# Altium schematic sheet chipshouter-pico-hv.SchDoc: High Voltage Circuitry
size Letter; Organization: NewAE Technology Inc.; Address1: 1083 Queen St., Suite 196; Address2: Halifax; Address3: NS; Address4: Canada B3H 0B2; DocumentNumber: .; Revision: .; SheetNumber: 1; SheetTotal: 2; SheetApproved: YES
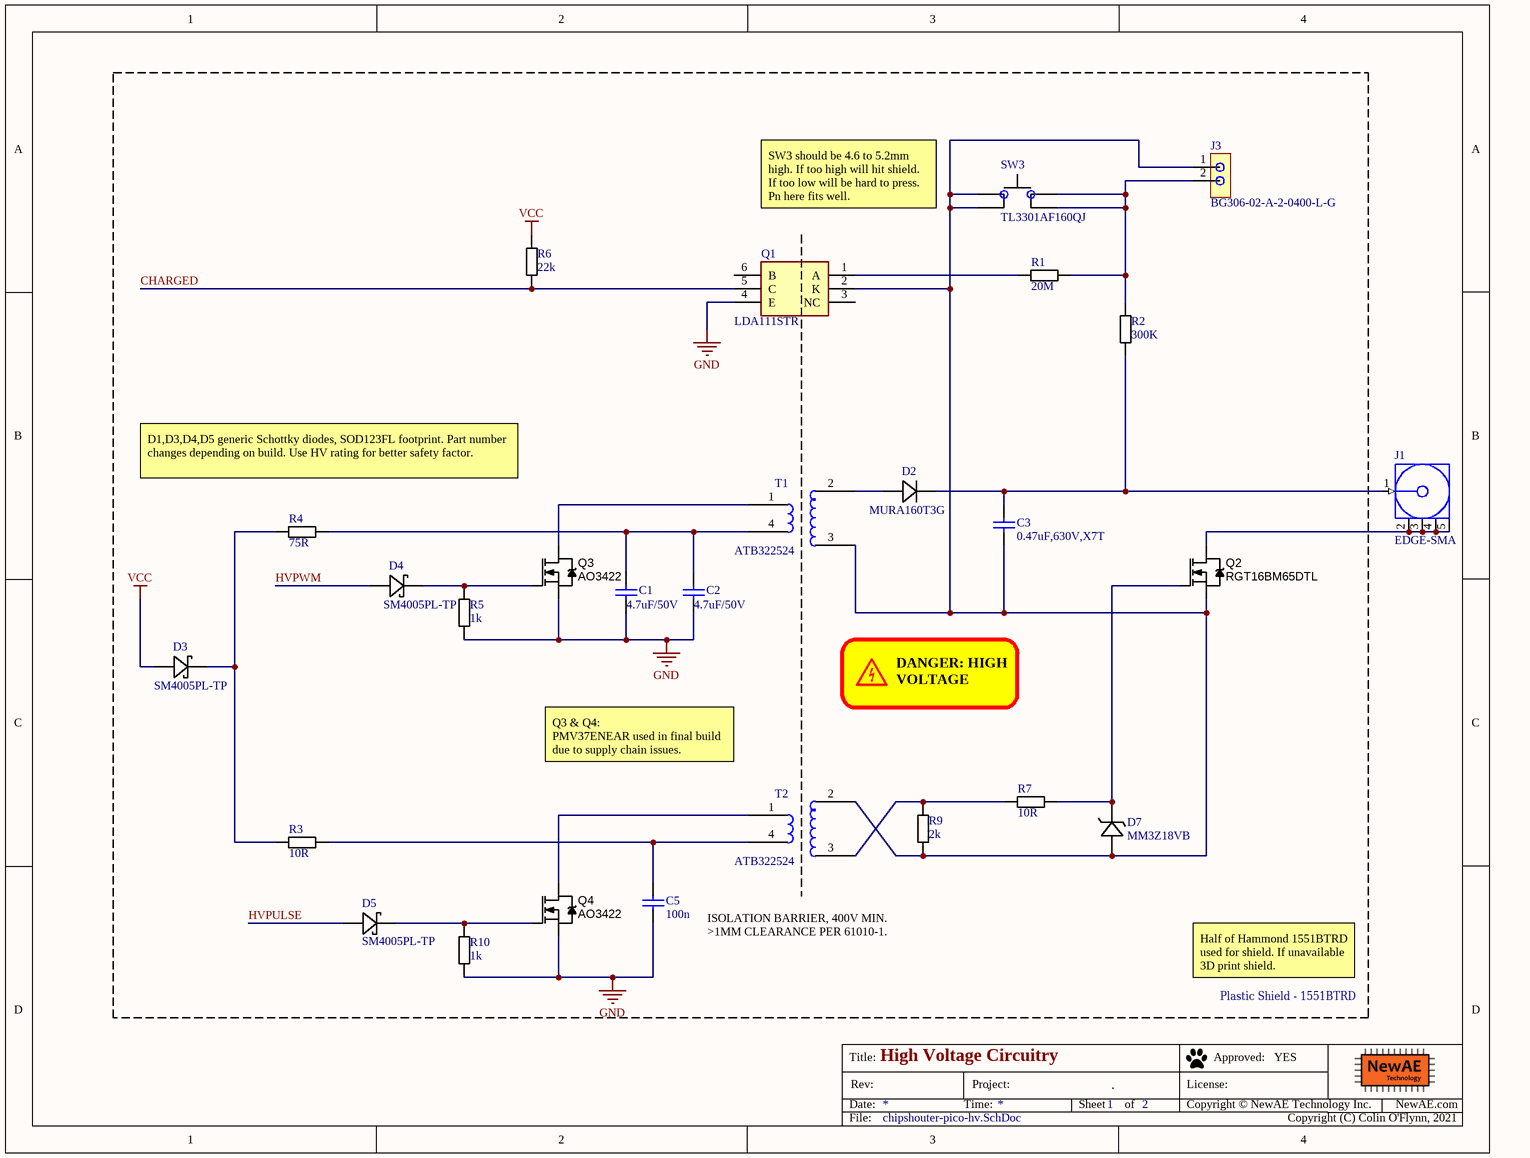
[diagram p0: chipshouter-pico-hv.SchDoc]

## Parts
C1  4.7uF/50V  [CAPC0805_M]
C2  4.7uF/50V  [CAPC0805_M]
C3  0.47uF,630V,X7T  [CKG57N_2220]
C5  100n  [CAPC0603_M]
D2  MURA160T3G  [DO-214AC]
D3  SM4005PL-TP  [DSS13UTR]
D4  SM4005PL-TP  [DSS13UTR]
D5  SM4005PL-TP  [DSS13UTR]
D7  MM3Z18VB  [SOD323]
J1  EDGE-SMA  [CON-SMA-MALE-PCB-EDGE062]
J3  BG306-02-A-2-0400-L-G  [BG306-R2-2PIN]
Q1  LDA111STR  [SOP254P952X470-6N]
Q2  RGT16BM65DTL  [DPAK_TO-252AA_M]
Q3  AO3422  [SOT95P245X110-3M]
Q4  AO3422  [SOT95P245X110-3M]
R1  20M  [RESC5025X06N]
R2  300K  [RESC6432X06N]
R3  10R  [RESC1608X55N]
R4  75R  [RESC2012X70N]
R5  1k  [RESC1608X55N]
R6  22k  [RESC1608X55N]
R7  10R  [RESC1608X55N]
R9  2k  [RESC2012X70N]
R10  1k  [RESC1608X55N]
SW3  TL3301AF160QJ  [CK_KSC7J]
T1  ATB322524  [ATB322524_CHUNKY]
T2  ATB322524  [ATB322524_CHUNKY]

## Blocks framed on the sheet
Plastic Shield - 1551BTRD‎: C1-C3 C5 D2-D5 D7 J3 Q1-Q4 R1-R7 R9 R10 SW3 T1 T2

## Nets
GND: C1.2 C2.2 C5.2 Q1.4(E) Q3.2(S) Q4.2(S) R5.2 R10.2
VCC: D3.A R6.1
CHARGED: Q1.5(C) R6.2
HVPULSE: D5.A
HVPWM: D4.A
NetC1_1: C1.1 C2.1 R4.2 T1.4
NetC3_1: C3.1 D2.K J1.1(Signal) R2.2
NetC3_2: C3.2 D7.A J3.1 Q1.2(K) Q2.2(S) R9.2 SW3.1(IN) SW3.4(IN) T1.3 T2.2
NetC5_1: C5.1 R3.2 T2.4
NetD2_A: D2.A T1.2
NetD3_K: D3.K R3.1 R4.1
NetD4_K: D4.K Q3.1(G) R5.1
NetD5_K: D5.K Q4.1(G) R10.1
NetD7_K: D7.K Q2.1(G) R7.2
NetJ1_2: J1.2(GND) J1.3(GND) J1.4(GND) J1.5(GND) Q2.3(D)
NetJ3_2: J3.2 R1.2 R2.1 SW3.2(IN) SW3.3(IN)
NetQ1_1: Q1.1(A) R1.1
NetQ3_3: Q3.3(D) T1.1
NetQ4_3: Q4.3(D) T2.1
NetR7_1: R7.1 R9.1 T2.3

Not connected (* = marked no-connect by the designer): Q1 3(NC) 6(B)

## Notes on the sheet
- SW3 should be 4.6 to 5.2mm high. If too high will hit shield. If too low will be hard to press. Pn here fits well.
- D1,D3,D4,D5 generic Schottky diodes, SOD123FL footprint. Part number changes depending on build. Use HV rating for better safety factor.
- DANGER: HIGH
  VOLTAGE
- Q3 & Q4:
  PMV37ENEAR used in final build due to supply chain issues.
- ISOLATION BARRIER, 400V MIN.
  >1MM CLEARANCE PER 61010-1.
- Half of Hammond 1551BTRD used for shield. If unavailable 3D print shield.
- Copyright (C) Colin O'Flynn, 2021
- Title:
- Date:
- Rev:
- Time:
- Project:
- Sheet
- of
- License:
- Copyright © NewAE Technology Inc.
- Approved:
- NewAE.com
- File:

## Library data of the parts
C1 C2 = CCHIP-4u7-0805-50V: 4u7, 50V, 0805, Ceramic; Manufacture 1: TDK Corporation; Manufacture Part Number 1: C2012X5R1H475K125AB; Component Group: Capacitor; Value: 4.7uF; Case-EIA: 0805; Case-Metric: 1608; Rated Voltage: 50VDC; Tolerance: 10%; Part Number: CCHIP-4u7-0805-50V; Footprint: 0805; Pin Count: 2; Supplier 1: Digi-Key; Supplier Part Number 1: 445-5980-1-ND; Mounting Technology: SMT; RoHS: Yes; Temperature Range: -55C to 85C; Component Kind: Standard; Component Type: Standard
C3 = CKG57NX7T2J105M500JH: 1uF, 630V, X7T, Stacked; Part Number: KRM55TR72J474MH01K; Manufacture 1: TDK Corporation; Component Group: Capacitor; Case-EIA: 2220; Case-Metric: 5750; Tolerance: +22/-30; Manufacture Part Number 1: KRM55TR72J474MH01K; Pin Count: 2; Supplier 1: Digi-Key; Supplier Part Number 1: 445-7110-1-ND; Value: 0.47uF, 630V, X7T; Rated Voltage: 630V; ComponentLink1Description: Tech Spec Page; ComponentLink1URL: https://product.tdk.com/en/search/capacitor/ceramic/mlcc/info?part_no=CKG57NX7T2J105M500JJ; Component Kind: Standard; Component Type: Standard
C5 = CCHIP-100n-0603: 100n, 0603; Manufacture 1: Kemet; Manufacture Part Number 1: C0603C104K5RACTU; Component Group: Capacitor; Case-EIA: 0603; Case-Metric: 1608; Rated Voltage: 50VDC; Part Number: CCHIP-100n-0603; Footprint: 0603; Pin Count: 2; Supplier 1: Digi-Key; Supplier Part Number 1: 399-5089-2-ND; Value: 100n; Mounting Technology: SMT; Component Kind: Standard; Component Type: Standard
D2 = MURA160T3G: 600V, 2A, Fast Recovery Diode; Manufacture 1: On Semi; Part Number: MURA160T3G; Component Group: Diode; Footprint: SMA; Manufacture Part Number 1: MURA160T3G; Pin Count: 2; Supplier 1: Digi-Key; Supplier Part Number 1: MURA160T3GOSCT-ND; Rated Power: 2A; Rated Voltage: 600V; Mounting Technology: SMT; RoHS: Yes; Temperature Range: -65C to 175C; Component Kind: Standard; Component Type: Standard
D3-D5 = DSS13UTR: SCHOTTKY 30V SOD-123FL; Manufacture 1: MCC; Component Group: Diode; PP Material Stack: 0; Part Number: DSS13UTR; Manufacture Part Number 1: SM4005PL-TP; Pin Count: 2; Supplier 1: Digi-Key; Supplier Part Number 1: 1655-1926-1-ND; Mounting Technology: SMT; RoHS: Yes; Component Kind: Standard; Component Type: Standard; PP Rotation: 0
D7 = PDZ10B: DIODE ZENER 10V 400MW SOD323; Manufacture 1: On Semiconductor; Rated Power: 0.4W; Tolerance: 2%; PP Material Stack: 0; Part Number: MM3Z18VB; Component Group: Diode; Manufacture Part Number 1: MM3Z18VB; Pin Count: 2; Supplier 1: Digi-Key; Supplier Part Number 2: 771-PDZ10B115; Supplier 2: Mouser; Rated Voltage: 10V; Mounting Technology: SMT; RoHS: Yes; Component Kind: Standard; Component Type: Standard; PP Rotation: 0
J1 = CON-F-SMA-PCBEDGE-003.062: SMA MaleEdge Mount Connector for 0.062" Thick Board; Manufacture 1: Linx Technologies; Manufacture Part Number 1: CONSMA013.062; Part Number: CON-F-SMA-PCBEDGE-003.062; Component Group: Connector; Pin Count: 5; Supplier 1: Digi-Key; Supplier Part Number 1: CONSMA013.062-ND; ComponentLink1Description: Manufacturer URL; ComponentLink1URL: http://www.linxtechnologies.com/; ComponentLink2Description: Datasheet; ComponentLink2URL: http://www.connectorcity.com/diagrams/SMA/CONSMA003.062.pdf; Component Kind: Standard; Component Type: Standard
J3 = BG306-02-A-2-0400-L-G: 2-Pin SMD, Female Header, 0.1" spacing; Manufacture 1: GCT; Component Group: Connector; PP Material Stack: 0; Part Number: BG306-02-A-2-0400-L-G; Footprint: BG306-R2; Manufacture Part Number 1: BG306-02-A-2-0400-L-G; Pin Count: 2; Supplier 1: Digi-Key; Component Kind: Standard; Component Type: Standard; PP Rotation: 0; PP Rotation1: 0
Q1 = LDA111STR: Phototransistor; Manufacturer_Name: IXYS SEMICONDUCTOR; Datasheet Link: https://datasheet.datasheetarchive.com/originals/dk/DKDS-13/255385.pdf; Height: 4.699mm; Manufacturer_Part_Number: LDA111STR; Mouser Part Number: 849-LDA111STR; Mouser Price/Stock: https://www.mouser.co.uk/ProductDetail/IXYS-Integrated-Circuits/LDA111STR?qs=lQlU%252BwB40guZJ8WaenQLCg%3D%3D; Arrow Part Number: LDA111STR; Arrow Price/Stock: https://www.arrow.com/en/products/lda111str/ixys
Q2 = IRLR120TRPBF: MOSFET N-CH 100V 7.7A DPAK; Manufacture 1: Vishay Siliconix; Part Number: IRLR120TRPBF; Component Group: MOSFET; Footprint: DPAK; Manufacture Part Number 1: IRLR120TRPBF; Pin Count: 3; Supplier 1: Digi-Key; Supplier Part Number 1: IRLR120TRPBFCT-ND; Rated Voltage: 100V; Mounting Technology: SMT; RoHS: Yes; Component Kind: Standard; Component Type: Standard
Q3 Q4 = DMN3200U-7: MOSFET N-CH 30V 2.2A SOT23-3; Manufacture 1: Diodes Inc.; Rated Power: 3A; PP Material Stack: 0; Part Number: DMN3200U-7; Component Group: MOSFET; Footprint: SOT23; Manufacture Part Number 1: DMN3200U-7; Pin Count: 3; Supplier 1: Digi-Key; Supplier Part Number 1: DMN3200U-7DICT-ND; Rated Voltage: 30V; Mounting Technology: SMT; RoHS: Yes; Component Kind: Standard; Component Type: Standard; PP Rotation: 0
R1 = RCHIP-20M-2010: 20M, 2010, 1%; Manufacture 1: Vishay; Manufacture Part Number 1: CRMA2010AF20M0FKEF; Component Group: Resistor; Case-EIA: 2010; Case-Metric: 5025; Rated Power: 0.5W; Rated Voltage: 400VDC; Part Number: RCHIP-20M-2010; Footprint: 2010; Pin Count: 2; Supplier 1: Digi-Key; Value: 20M; Tolerance: 1%; Mounting Technology: SMT; Temperature Range: -55C to 155C; Component Kind: Standard; Component Type: Standard
R2 = RCHIP-300K-2512: 300K res, 2512, 1%, 3W; Manufacture 1: TE Connectivity; Manufacture Part Number 1: 3522300KFT; Component Group: Resistor; Case-EIA: 2512; Case-Metric: 6432; Rated Voltage: 250V; Part Number: RCHIP-300K-2512; Footprint: 2512; Pin Count: 2; Supplier 1: Digi-Key; Supplier Part Number 1: A121215CT-ND; Value: 300K; Rated Power: 3W; Tolerance: 1%; Mounting Technology: SMT; RoHS: Yes; Temperature Range: -55C to 155C; Component Kind: Standard; Component Type: Standard
R3 R7 = RCHIP-10R-0603: 10R res, 0603, 1%, 1/10W; Manufacture 1: Yageo; Manufacture Part Number 1: RC0603FR-0710RL; Component Group: Resistor; Case-EIA: 0603; Case-Metric: 1608; Rated Power: 0.1W; Rated Voltage: 75VDC; Part Number: RCHIP-10R-0603; Footprint: 0603; Pin Count: 2; Supplier 1: Digi-Key; Supplier Part Number 1: 311-10.0HRCT-ND; Value: 10R; Tolerance: 1%; Mounting Technology: SMT; Temperature Range: -55C to 155C; Component Kind: Standard; Component Type: Standard
R4 = RCHIP-75R-0805: 75R res, 0805, 1%, 1/8W; Manufacture 1: Yageo; Manufacture Part Number 1: RC0805FR-0775RL; Component Group: Resistor; Case-EIA: 0805; Rated Power: 0.125W; Rated Voltage: 75VDC; Part Number: RCHIP-75R-0805; Footprint: 0805; Pin Count: 2; Supplier 1: Digi-Key; Supplier Part Number 1: 311-75.0CRCT-ND; Value: 75R; Tolerance: 1%; Mounting Technology: SMT; Temperature Range: -55C to 155C; Component Kind: Standard; Component Type: Standard
R5 R10 = RCHIP-1K-0603: 1k res, 0603, 1%, 1/10W; Manufacture 1: Yageo; Manufacture Part Number 1: RC0603FR-071KL; Component Group: Resistor; Case-EIA: 0603; Case-Metric: 1608; Rated Power: 0.1W; Rated Voltage: 75VDC; Part Number: RCHIP-1K-0603; Footprint: 0603; Pin Count: 2; Supplier 1: Digi-Key; Supplier Part Number 1: 311-1.00KHRCT-ND; Value: 1k; Tolerance: 1%; Mounting Technology: SMT; Temperature Range: -55C to 155C; Component Kind: Standard; Component Type: Standard
R6 = RCHIP-22K-0603: 22k res, 0603, 1%, 1/10W; Manufacture 1: Yageo; Manufacture Part Number 1: RC0603FR-0722KL; Component Group: Resistor; Case-EIA: 0603; Case-Metric: 1608; Rated Power: 0.1W; Rated Voltage: 75VDC; Part Number: RCHIP-22K-0603; Footprint: 0603; Pin Count: 2; Supplier 1: Digi-Key; Supplier Part Number 1: 311-22.0KHRCT-ND; Value: 22k; Tolerance: 1%; Mounting Technology: SMT; Temperature Range: -55C to 155C; Component Kind: Standard; Component Type: Standard
R9 = RCHIP-75R-0805: Manufacture 1: Yageo; Manufacture Part Number 1: RC0805FR-0775RL; Component Group: Resistor; Value: 75R; Case-EIA: 0805; Rated Power: 0.125W; Rated Voltage: 75VDC; Tolerance: 1%; Part Number: RCHIP-75R-0805; Footprint: 0805; Pin Count: 2; Supplier 1: Digi-Key; Supplier Part Number 1: 311-75.0CRCT-ND; Mounting Technology: SMT; Temperature Range: -55C to 155C; Component Kind: Standard; Component Type: Standard
SW3 = TACTSW-KSC741J: SWITCH TACTILE SPST-NO 0.01A 32V; Manufacture 1: E-Switch; PP Material Stack: 0; Part Number: TACTSW-KSC741J; Component Group: Switch; Manufacture Part Number 1: TL3301AF160QJ; Pin Count: 4; Supplier 1: Digi-Key; Supplier Part Number 1: CKN10309CT-ND; Mounting Technology: SMT; RoHS: Yes; Component Kind: Standard; Component Type: Standard; PP Rotation: 0
T1 T2 = ATB322524_PROTO: HV Transformer 1:10, Small; Manufacture 1: TDK; Component Group: Inductor; Part Number: ATB322524_PROTO; Footprint: ATB322524; Manufacture Part Number 1: ATB322524; Pin Count: 4; Supplier 1: Mouser; Mounting Technology: SMT; RoHS: Yes; Component Kind: Standard; Component Type: Standard